# EAGLE design test (EAGLE 6.6.0)
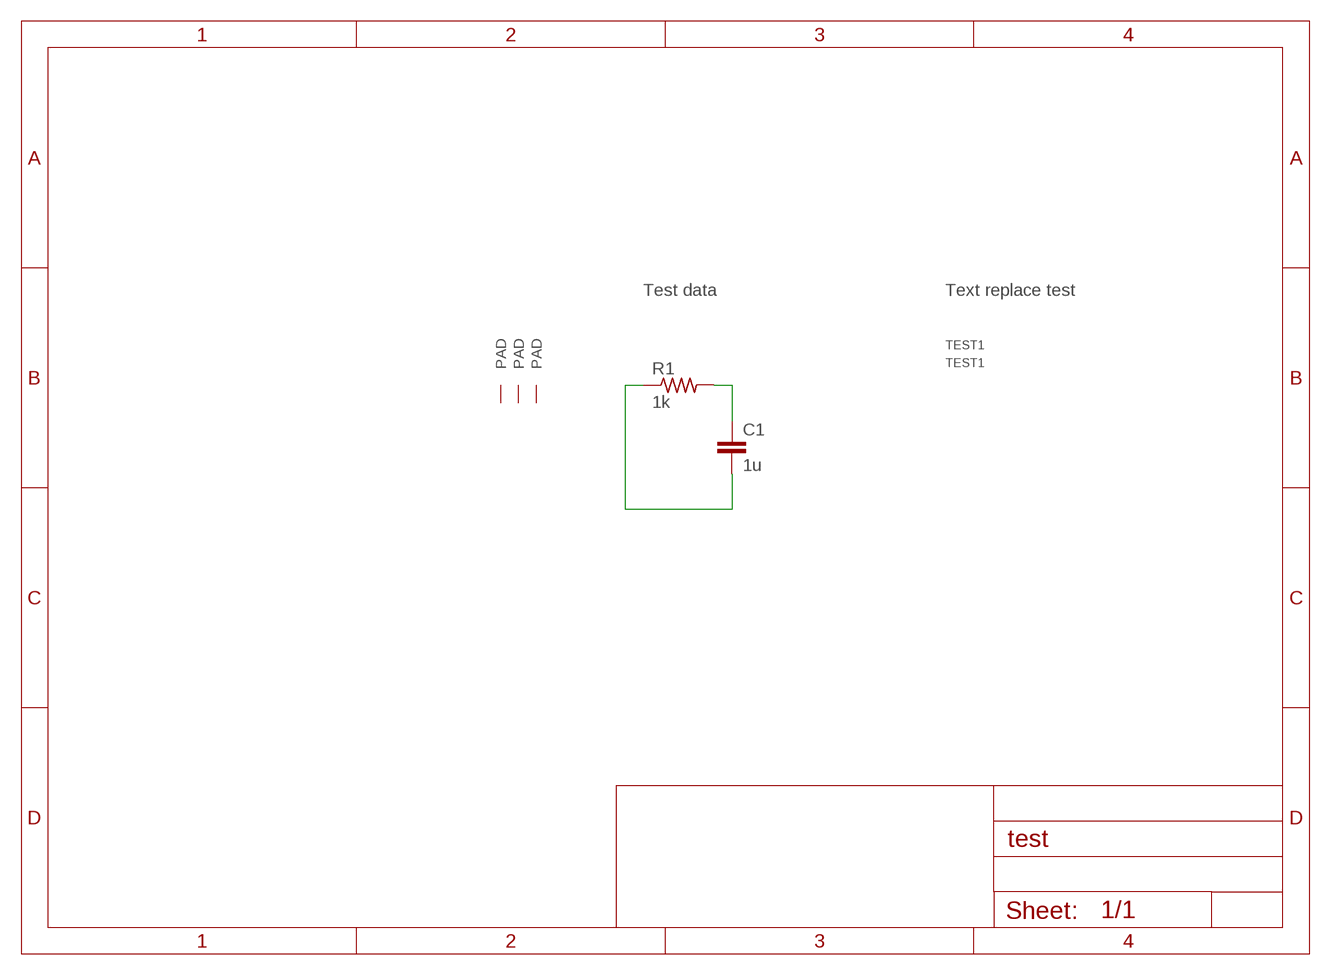
[diagram p0: schematic, sheet 1]

## Parts
C1  1u  C-EUC0402  [C0402]
PAD1  PADLONG  [LONG]
PAD2  PADOFFSET  [OFFSET]
PAD3  PADOFFSET  [OFFSET]
R1  1k  R-US_R0402  [R0402]

## Nets
N$1: C1.1 R1.2
N$2: C1.2 R1.1
Unconnected: PAD1.1(PAD) PAD2.1(PAD) PAD3.1(PAD)

## Notes on the sheet
- Test data | Text replace test

## Library data of the parts
C1 = rcl:C-EU: CAPACITOR, European symbol
PAD1-PAD3 = pad:PAD
R1 = rcl:R-US_: RESISTOR, American symbol

## Board
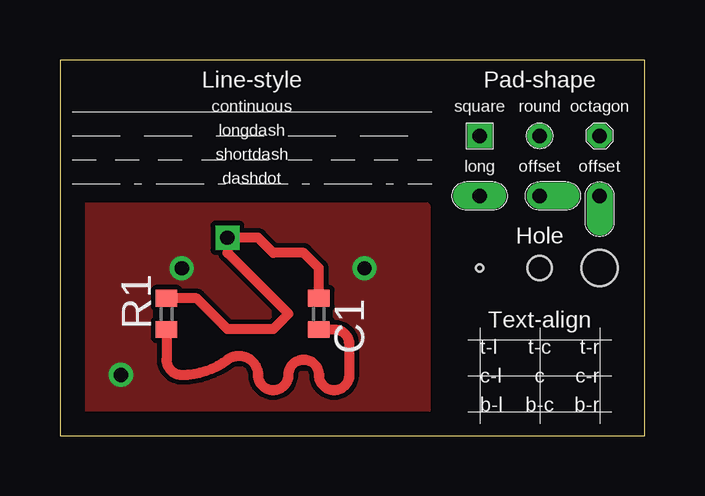
[diagram p1: board, top side]
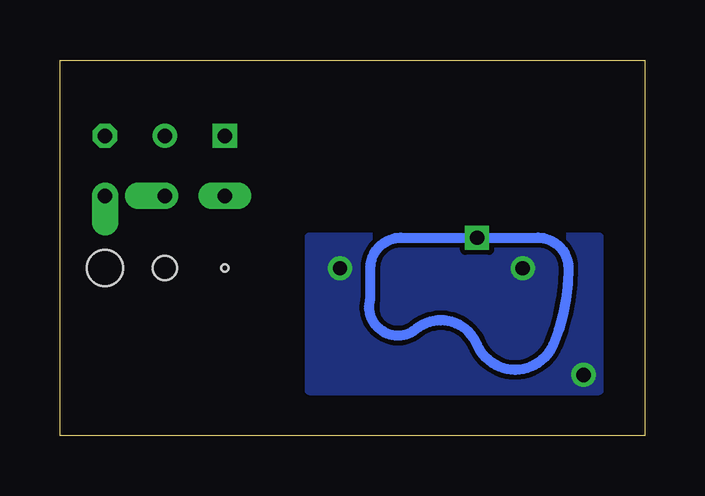
[diagram p2: board, bottom side, seen from below]

Size 24.38 x 15.66 mm. Coordinates in mm from the lower left corner, seen from the top.
Outline: 0,0 24.38,0 24.38,15.66 0,15.66 0,0
Copper layers (1*16): Top 0.035mm / dielectric 1.5mm / Bottom 0.035mm
Design rules "default": minimum track width 10mil, minimum drill 24mil, track to track 8mil, track to pad 8mil, pad to pad 8mil, via to via 8mil, smd to smd 8mil, copper to edge 40mil, drill to drill 8mil, minimum pad ring 10mil, minimum via ring 8mil, stop-mask expansion 4mil, vias tented up to drill 0mil, thermal gap 10mil
Holes 1 mm at 20,7
Holes 0.3 mm at 17.5,7
Holes 1.5 mm at 22.5,7

### Footprints (pad centres in the part's own frame; a part is rotated, then mirrored left to right if it is on the bottom)
C0402 = smd 0.7 x 0.9: 1 -0.65,0; 2 0.65,0
LONG = drill 0.6 long: 1 0,0
OFFSET = drill 0.6 offset: 1 0,0
R0402 = smd 0.7 x 0.9: 1 -0.65,0; 2 0.65,0

### Placement (x,y rotation side)
C1  10.79,5.08 270 top
PAD1  17.5,10 0 top
PAD2  20,10 0 top
PAD3  22.5,10 270 top
R1  4.45,5.08 90 top

### Tracks (layer width: path | path; a pad name or v marks a point on that pad's centre or on a via)
EARTH  (via drill 0.6)
  other vias: 2.54,2.54 12.7,6.99 5.08,6.99
  pour Top: 0.64,9.53 15.24,9.53 15.24,0.64 0.64,0.64
  pour Bottom: 1.91,8.26 13.97,8.26 13.97,1.91 1.91,1.91
N$1  (via drill 0.6)
  Top 0.406: C1.1 10.79,6.99 10.16,7.62 8.89,7.62 8.26,8.26 v6.99,8.26 6.99,7.62 9.53,5.08 8.89,4.45 6.99,4.45 5.7,5.73 R1.2
  Bottom 0.406: v6.99,8.26 4.45,8.26 arc90 3.17,6.99 arc23 3.81,3.81 arc135 6.99,3.81 arc-107 9.53,4.45 arc146 11.43,5.71 11.43,6.99 arc90 10.16,8.26 v6.99,8.26
N$2
  Top 0.406: R1.1 4.45,3.17 arc90 5.08,2.54 arc37 6.99,3.17 arc-127 8.26,2.54 arc180 9.53,2.54 arc-180 10.79,2.54 arc180 12.06,2.54 12.06,3.81 arc90 11.45,4.43 C1.2
N$3  (via drill 0.6)
  other vias: 17.5,12.5
N$4  (via drill 0.6)
  other vias: 20,12.5
N$5  (via drill 0.6)
  other vias: 22.5,12.5

### Text on the board
tPlace: Line-style | continuous | square | Pad-shape | round | octagon | longdash | shortdash | long | offset | offset | dashdot | Hole | t-l | Text-align | t-c | t-r | c-l | c | c-r | b-l | b-c | b-r